# Altium schematic sheet Memory_SCH.SchDoc
size A; SheetNumber: 4; SheetTotal: 9
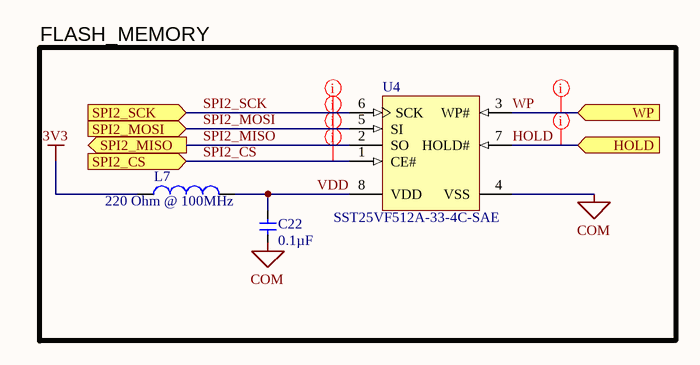
[diagram p0: Memory_SCH.SchDoc]

## Parts
C22  Capacitance: 0.1µF  [C0603]  (hidden comment: GRM188R71C104KA01D)
L7  Impedance @ Frequency: 220 Ohm @ 100MHz  [L0805]  (hidden comment: BLM21PG221SN1D)
U4  SST25VF512A-33-4C-SAE  [MCHP-SOIC-SA8_N]

## Blocks framed on the sheet
FLASH_MEMORY: C22 L7 U4

## Ports
HOLD (in), SPI2_CS (in), SPI2_MISO (out), SPI2_MOSI (in), SPI2_SCK (in), WP (in)

## Nets
3V3: L7.1
COM: C22.2 U4.4(VSS)
HOLD: U4.7(HOLD#) ; port HOLD
SPI2_CS: U4.1(CE#) ; port SPI2_CS
SPI2_MISO: U4.2(SO) ; port SPI2_MISO
SPI2_MOSI: U4.5(SI) ; port SPI2_MOSI
SPI2_SCK: U4.6(SCK) ; port SPI2_SCK
VDD: C22.1 L7.2 U4.8(VDD)
WP: U4.3(WP#) ; port WP

## Layout directives
net class 50_Ohm: HOLD, SPI2_CS, SPI2_MISO, SPI2_MOSI, SPI2_SCK, WP

## Library data of the parts
C22 = GRM188R71C104KA01D: CAP CER 0.1UF 16V 10% X7R 0603; ComponentLink1Description: Datasheet; ComponentLink1URL: http://search.murata.co.jp/Ceramy/image/img/A01X/G101/ENG/GRM188R71C104KA01-01.pdf; ComponentLink2URL: http://media.digikey.com/photos/Murata%20Photos/0603%20Murata%20MLCC%20Caps.jpg; ComponentLink2Description: Photo; Pricing 1: 1=0.13 (USD); Tolerance: ±10%; Operating Temperature: -55°C ~ 125°C; Applications: General Purpose; Supplier 1: Digi-Key; Supplier Part Number 1: 490-1532-1-ND; Temperature Coefficient: X7R; Voltage - Rated: 16V
L7 = BLM21PG221SN1D: FERRITE CHIP 220 OHM 0805; Current Rating: 2A; DC Resistance (DCR): 45 mOhm Max; Filter Type: Differential Mode - Single; Supplier 1: Digi-Key; Supplier Part Number 1: 490-1054-1-ND; ComponentLink1URL: http://search.murata.co.jp/Ceramy/image/img/PDF/ENG/L0110S0100BLM21P.pdf; ComponentLink1Description: datasheet; ComponentLink2URL: http://media.digikey.com/photos/Murata%20Photos/BLM21%20SERIES%200805.jpg; ComponentLink2Description: photo
U4 = CMP-0378-00091-1: 512 Kbit SPI Serial Flash, 2.7 to 3.6 V, 33 MHz, 0 to 70 degC, 8-pin SOIC (SA8), Tube; Manufacturer: Microchip; PackageDescription: 8-Lead Plastic Small Outline, 4.9 x 3.9 mm Body, 1.27 mm Pitch; ComponentLink1URL: http://www.microchip.com; ComponentLink1Description: Manufacturer URL; Code_JEDEC: MS-012; Mounting Technology: Surface Mount; PackageReference: SOIC-SA8; ComponentLink4Description: Product URL; ComponentLink3URL: http://ww1.microchip.com/downloads/en/DeviceDoc/25080A.pdf; ComponentLink2URL: http://ww1.microchip.com/downloads/en/DeviceDoc/25090A.pdf; ComponentLink2Description: Datasheet; ComponentLink4URL: http://www.microchip.com/SST25VF512A; PartNumber: SST25VF512A-33-4C-SAE; DatasheetVersion: DS25090A; ComponentLink3Description: Package Specification; PackageVersion: Rev. A